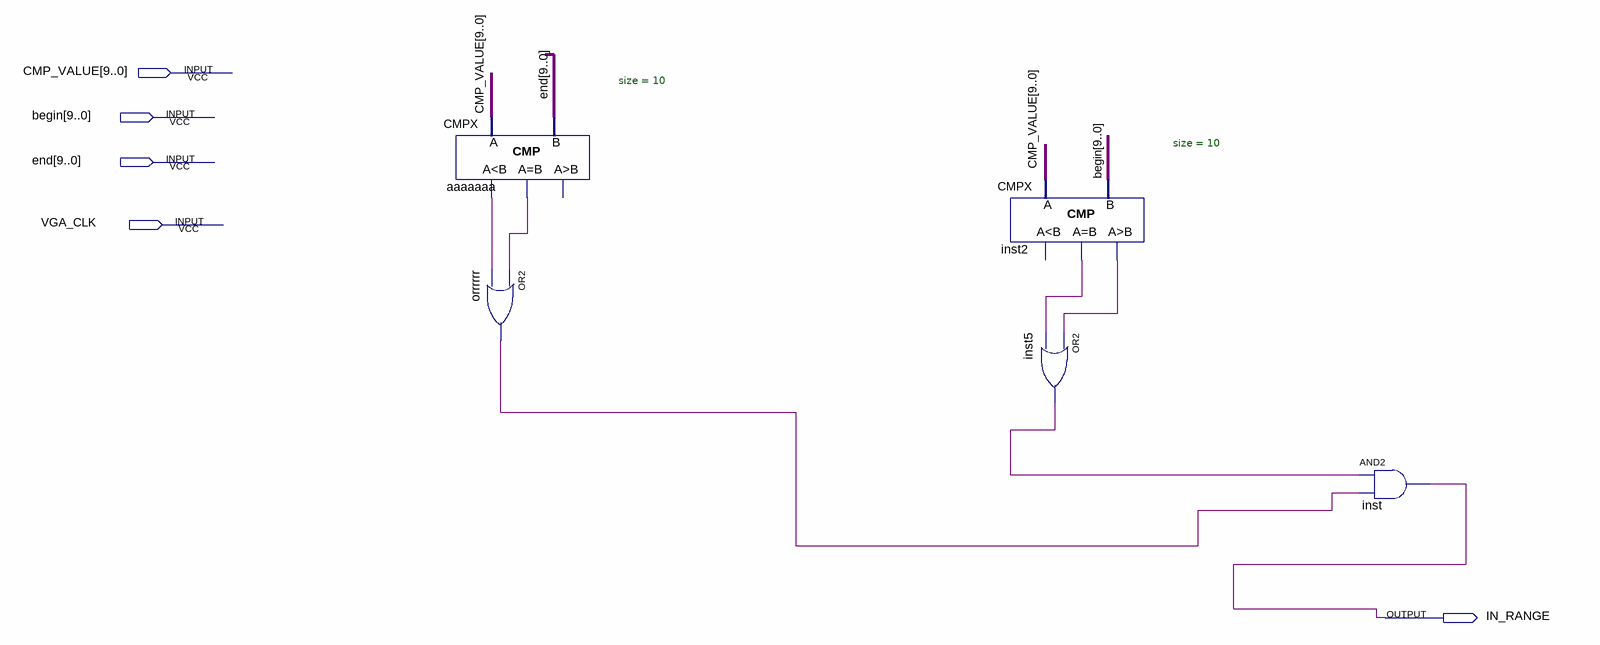
[diagram p0: schematic sheet]
// Quartus schematic inRangeCMP10.bdf as structural Verilog: 5 symbols, 5 pins
module inRangeCMP10 (
  input  [9:0] CMP_VALUE,
  input  [9:0] \begin ,
  input  [9:0] \end ,
  input  VGA_CLK,
  output IN_RANGE
);

  wire aaaaaaa_eq, aaaaaaa_ls, inst2_eq, inst2_gr, inst5_out, orrrrrr_out;

  CMPX #(.size(10)) aaaaaaa (.A(CMP_VALUE), .B(\end ), .ls(aaaaaaa_ls), .eq(aaaaaaa_eq));  // open: gr
  or orrrrrr (orrrrrr_out, aaaaaaa_eq, aaaaaaa_ls);
  CMPX #(.size(10)) inst2 (.A(CMP_VALUE), .B(\begin ), .eq(inst2_eq), .gr(inst2_gr));  // open: ls
  or inst5 (inst5_out, inst2_gr, inst2_eq);
  and inst (IN_RANGE, inst5_out, orrrrrr_out);
endmodule
